# EAGLE design ARE_adaptadora_PIC_28pin (EAGLE 6.5.0)
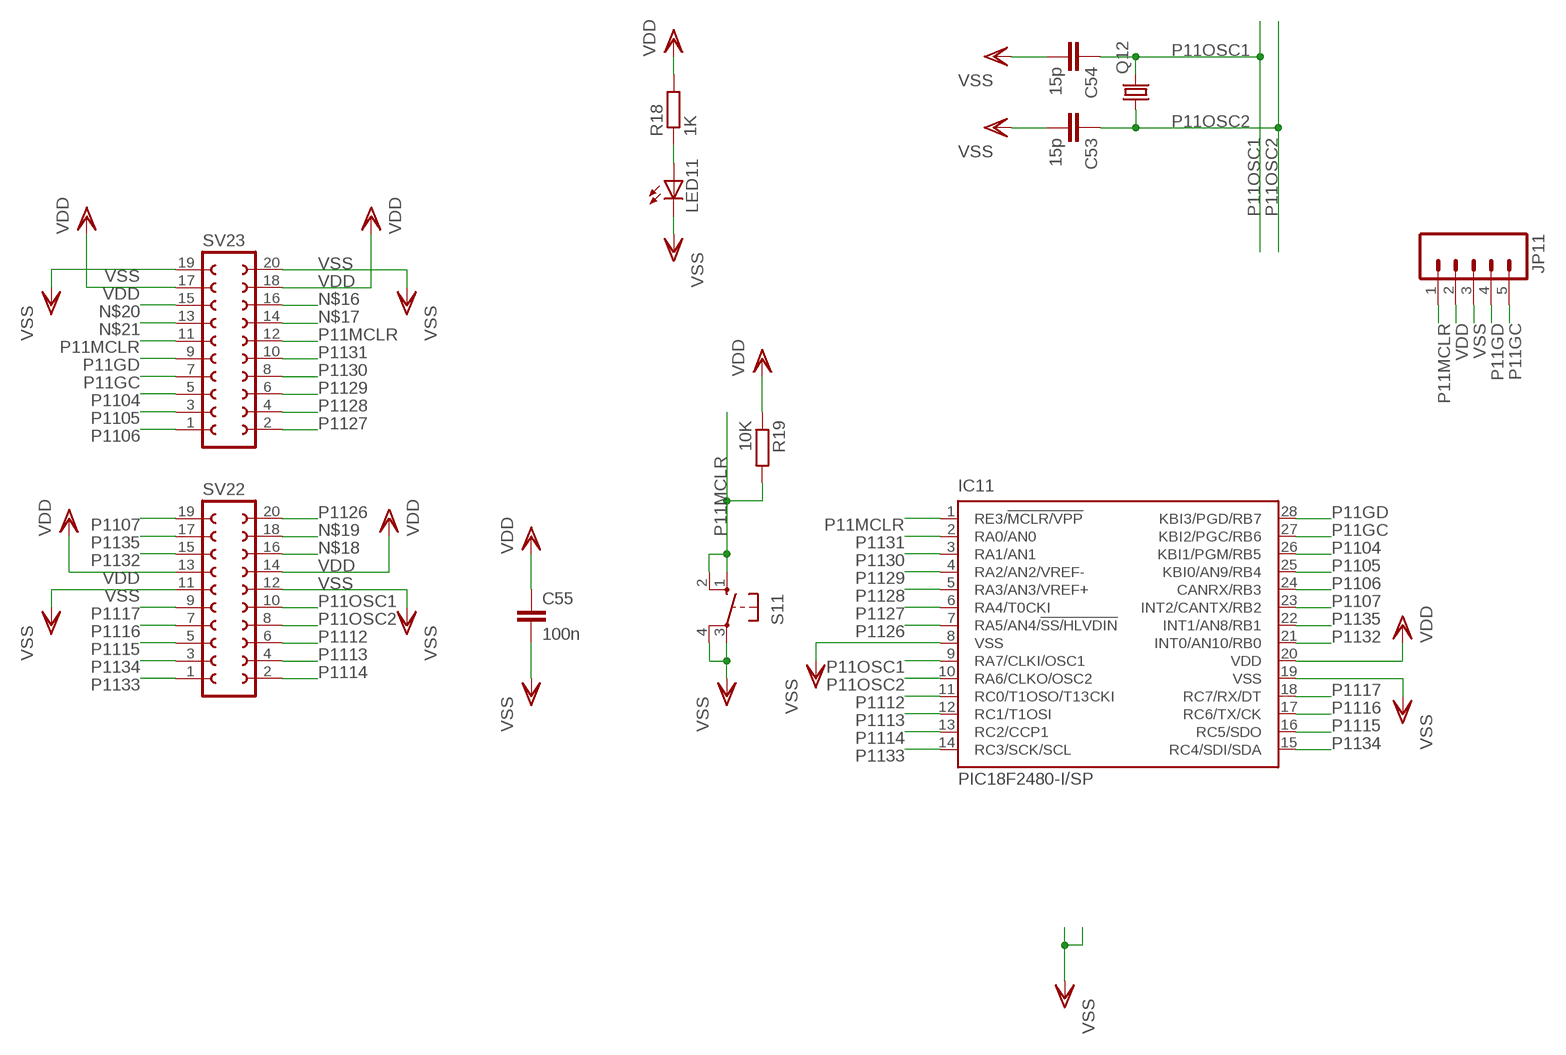
[diagram p0: schematic, sheet 1]

## Parts
C53  15p  C-EUC0805  [C0805]
C54  15p  C-EUC0805  [C0805]
C55  100n  C-EUC0805  [C0805]
IC11  PIC18F2480-I/SP  [DIL28-3]
JP11  M05PTH  [1X05]
LED11  LED3MM  [LED3MM]
Q12  CRYSTALHC18U-V  [HC18U-V]
R18  1K  R-EU_R0805  [R0805]
R19  10K  R-EU_R0805  [R0805]
S11  10-XX  [B3F-10XX]
SV22  FE10-2W  [FE10-2W]
SV23  FE10-2W  [FE10-2W]

## Nets
N$15: LED11.A R18.1
N$16: SV23.16
N$17: SV23.14
N$18: SV22.16
N$19: SV22.18
N$20: SV23.15
N$21: SV23.13
P11GC: IC11.27(KBI2/PGC/RB6) JP11.5 SV23.7
P11GD: IC11.28(KBI3/PGD/RB7) JP11.4 SV23.9
P11MCLR: IC11.1(RE3/!MCLR/VPP) JP11.1 R19.2 S11.1(S) S11.2(S1) SV23.11 SV23.12
P11OSC1: C54.1 IC11.9(RA7/CLKI/OSC1) Q12.2 SV22.10
P11OSC2: C53.1 IC11.10(RA6/CLKO/OSC2) Q12.1 SV22.8
P1104: IC11.26(KBI1/PGM/RB5) SV23.5
P1105: IC11.25(KBI0/AN9/RB4) SV23.3
P1106: IC11.24(CANRX/RB3) SV23.1
P1107: IC11.23(INT2/CANTX/RB2) SV22.19
P1112: IC11.11(RC0/T1OSO/T13CKI) SV22.6
P1113: IC11.12(RC1/T1OSI) SV22.4
P1114: IC11.13(RC2/CCP1) SV22.2
P1115: IC11.16(RC5/SDO) SV22.5
P1116: IC11.17(RC6/TX/CK) SV22.7
P1117: IC11.18(RC7/RX/DT) SV22.9
P1126: IC11.7(RA5/AN4/!SS/HLVDIN) SV22.20
P1127: IC11.6(RA4/T0CKI) SV23.2
P1128: IC11.5(RA3/AN3/VREF+) SV23.4
P1129: IC11.4(RA2/AN2/VREF-) SV23.6
P1130: IC11.3(RA1/AN1) SV23.8
P1131: IC11.2(RA0/AN0) SV23.10
P1132: IC11.21(INT0/AN10/RB0) SV22.15
P1133: IC11.14(RC3/SCK/SCL) SV22.1
P1134: IC11.15(RC4/SDI/SDA) SV22.3
P1135: IC11.22(INT1/AN8/RB1) SV22.17
VDD: C55.1 IC11.20(VDD) JP11.2 R18.2 R19.1 SV22.13 SV22.14 SV23.17 SV23.18
VSS: C53.2 C54.2 C55.2 IC11.8(VSS) IC11.19(VSS) JP11.3 LED11.K(C) S11.3(P) S11.4(P1) SV22.11 SV22.12 SV23.19 SV23.20

## Library data of the parts
C53-C55 = rcl:C-EU: CAPACITOR, European symbol
IC11 = microchip:PIC18F2*80: 28-Pin Enhanced Flash Microcontrollers with ECAN(TM) Technology 10-Bit A/D and nanoWatt Technology Source: http://www.microchip.com .. 39637a.pdf; MF: MICROCHIP; MPN: PIC18F2480-I/SP; OC_FARNELL: 9321217; OC_NEWARK: 71J7237
JP11 = SparkFun:M05: Header 5 Standard 5-pin 0.1" header. Use with straight break away headers (SKU : PRT-00116), right angle break away headers (PRT-00553), swiss pins (PRT-00743), machine pins (PRT-00117), and female headers (PRT-00115). Molex polarized connector foot print use with SKU : PRT-08230 with associated crimp pins and housings.
LED11 = SparkFun:LED: LEDs Standard schematic elements and footprints for 5mm, 3mm, 1206, and 0603 sized LEDs. 5mm - Spark Fun Electronics SKU : COM-00529 (and others)
Q12 = crystal:CRYSTAL: CRYSTAL; OC_FARNELL: unknown; OC_NEWARK: unknown
R18 R19 = rcl:R-EU_: RESISTOR, European symbol
S11 = switch-omron:10-XX: OMRON SWITCH; MPN: B3F-1000; OC_FARNELL: 176432; OC_NEWARK: 36M3542
SV22 SV23 = con-lsta:FE10-2W: FEMALE HEADER; OC_FARNELL: unknown; OC_NEWARK: unknown

## Board
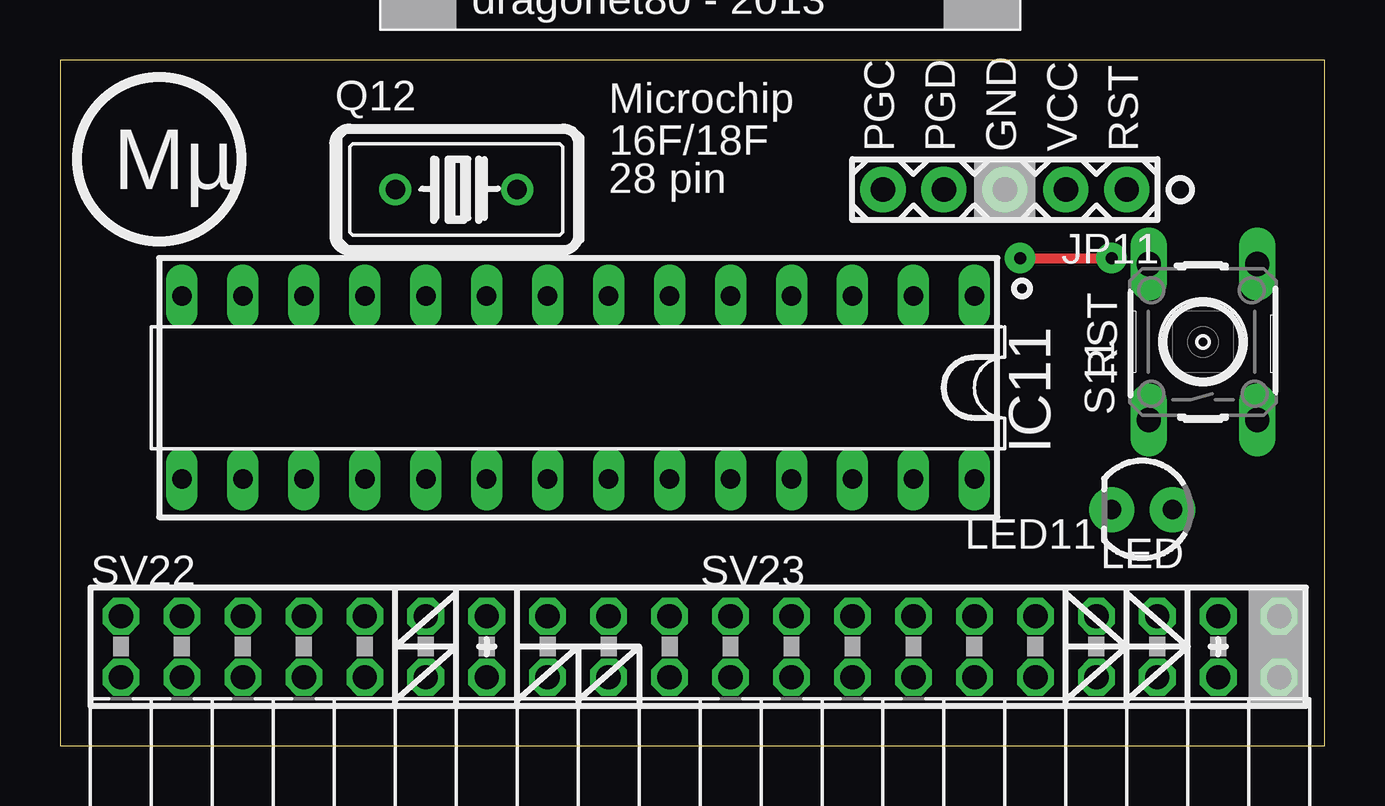
[diagram p1: board, top side]
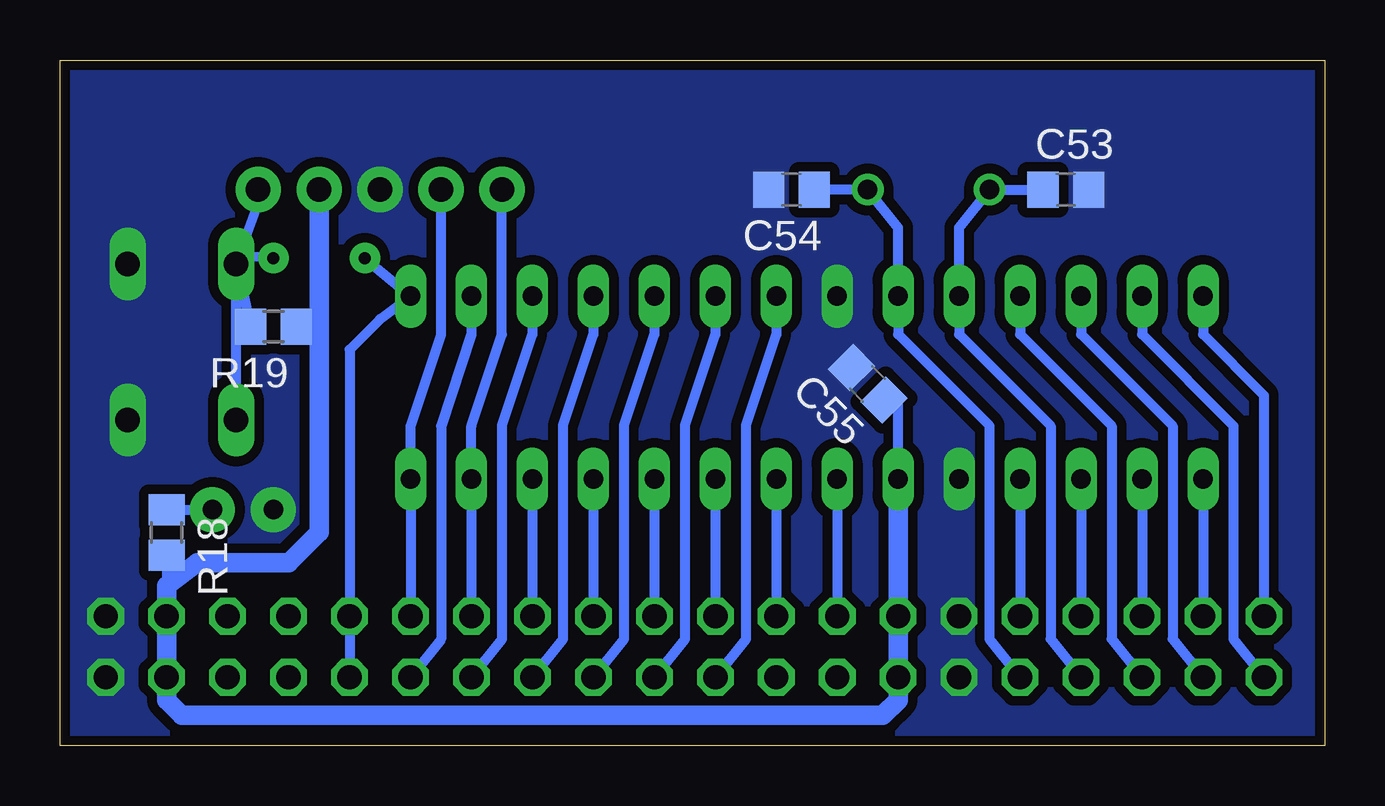
[diagram p2: board, bottom side, seen from below]

Size 52.7 x 28.57 mm. Coordinates in mm from the lower left corner, seen from the top.
Outline: 0,0 52.7,0 52.7,28.58 0,28.58 0,0
Copper layers (1*16): Top 0.035mm / dielectric 1.5mm / Bottom 0.035mm
Design rules "ITEADstudio_DRC": minimum track width 6mil, minimum drill 12mil, track to track 6mil, track to pad 6mil, pad to pad 6mil, via to via 6mil, smd to smd 0mil, copper to edge 10mil, drill to drill 10mil, minimum pad ring 10mil, minimum via ring 6mil, stop-mask expansion 2mil, vias tented up to drill 100mil, thermal gap 10mil

### Footprints (pad centres in the part's own frame; a part is rotated, then mirrored left to right if it is on the bottom)
C0805 = smd 1.3 x 1.5: 1 -0.95,0; 2 0.95,0
DIL28-3 = drill 0.813 long: 1 -16.51,-3.81; 2 -13.97,-3.81; 3 -11.43,-3.81; 4 -8.89,-3.81; 5 -6.35,-3.81; 6 -3.81,-3.81; 7 -1.27,-3.81; 8 1.27,-3.81; 9 3.81,-3.81; 10 6.35,-3.81; 11 8.89,-3.81; 12 11.43,-3.81; 13 13.97,-3.81; 14 16.51,-3.81; 15 16.51,3.81; 16 13.97,3.81; 17 11.43,3.81; 18 8.89,3.81; 19 6.35,3.81; 20 3.81,3.81; 21 1.27,3.81; 22 -1.27,3.81; 23 -3.81,3.81; 24 -6.35,3.81; 25 -8.89,3.81; 26 -11.43,3.81; 27 -13.97,3.81; 28 -16.51,3.81
1X05 = drill 1.016 pad 1.88: 1 0,0; 2 2.54,0; 3 5.08,0; 4 7.62,0; 5 10.16,0
LED3MM = drill 0.813 pad 1.88: A -1.27,0; K 1.27,0
HC18U-V = drill 0.813: 1 -2.54,0; 2 2.54,0
R0805 = smd 1.3 x 1.5: 1 -0.95,0; 2 0.95,0
B3F-10XX = drill 1.016 long: 1 -3.251,2.261; 2 3.251,2.261; 3 -3.251,-2.261; 4 3.251,-2.261
FE10-2W = drill 1.016 octagon: 1 -11.43,1.27; 2 -11.43,-1.27; 3 -8.89,1.27; 4 -8.89,-1.27; 5 -6.35,1.27; 6 -6.35,-1.27; 7 -3.81,1.27; 8 -3.81,-1.27; 9 -1.27,1.27; 10 -1.27,-1.27; 11 1.27,1.27; 12 1.27,-1.27; 13 3.81,1.27; 14 3.81,-1.27; 15 6.35,1.27; 16 6.35,-1.27; 17 8.89,1.27; 18 8.89,-1.27; 19 11.43,1.27; 20 11.43,-1.27

### Placement (x,y rotation side)
C53  10.8,23.18 0 bottom
C54  22.23,23.18 180 bottom
C55  19.05,15.08 135 bottom
IC11  21.59,14.92 180 top
JP11  44.45,23.18 180 top
LED11  45.08,9.84 180 top
Q12  16.51,23.18 0 top
R18  48.26,8.89 270 bottom
R19  43.81,17.46 180 bottom
S11  47.62,16.83 90 top
SV22  13.97,4.13 0 top
SV23  39.37,4.13 0 top

### Tracks (layer width: path | path; a pad name or v marks a point on that pad's centre or on a via)
N$15
  Bottom 0.406: R18.1 47.62,9.84 LED11.A
P11GC
  Bottom 0.406: JP11.5 34.29,17.15 35.56,13.34 IC11.27 SV23.7
P11GD
  Bottom 0.406: JP11.4 36.83,17.15 38.1,13.34 IC11.28 SV23.9
P11MCLR  (via drill 0.5 pad 1.27)
  Top 0.406: v40,20.32 v43.81,20.32
  Bottom 0.406: SV23.12 SV23.11 40.64,16.51 39.37,17.78 IC11.1 v40,20.32 | S11.1 45.36,18.69 45.08,19.05 | S11.2 45.36,19.41 45.08,19.05 | R19.2 45.08,19.05 | S11.2 44.45,22.58 JP11.1 | v43.81,20.32 45.01,20.4 S11.2
P11OSC1
  Bottom 0.406: SV22.10 13.97,4.44 13.97,13.34 17.78,17.15 IC11.9 17.78,21.59 Q12.2 C54.1
P11OSC2
  Bottom 0.406: SV22.8 11.43,4.44 11.43,13.34 15.24,17.15 IC11.10 15.24,21.59 Q12.1 C53.1
P1104
  Bottom 0.406: IC11.26 SV23.5
P1105
  Bottom 0.406: IC11.25 SV23.3
P1106
  Bottom 0.406: IC11.24 SV23.1
P1107
  Bottom 0.406: IC11.23 SV22.19
P1112
  Bottom 0.406: IC11.11 12.7,17.15 8.89,13.34 8.89,4.44 SV22.6
P1113
  Bottom 0.406: IC11.12 10.16,17.15 6.35,13.34 6.35,4.44 SV22.4
P1114
  Bottom 0.406: IC11.13 7.62,17.15 3.81,13.34 3.81,4.44 SV22.2
P1115
  Bottom 0.406: IC11.16 SV22.5
P1116
  Bottom 0.406: IC11.17 SV22.7
P1117
  Bottom 0.406: IC11.18 SV22.9
P1126
  Bottom 0.406: IC11.7 22.86,17.15 24.13,13.34 24.13,4.44 SV22.20
P1127
  Bottom 0.406: IC11.6 25.4,17.15 26.67,13.34 26.67,4.44 SV23.2
P1128
  Bottom 0.406: IC11.5 27.94,17.15 29.21,13.34 29.21,4.44 SV23.4
P1129
  Bottom 0.406: IC11.4 30.48,17.15 31.75,13.34 31.75,4.44 SV23.6
P1130
  Bottom 0.406: IC11.3 33.02,17.15 34.29,13.34 34.29,4.44 SV23.8
P1131
  Bottom 0.406: IC11.2 35.56,17.15 36.83,13.34 36.83,4.44 SV23.10
P1132
  Bottom 0.406: IC11.21 SV22.15
P1133
  Bottom 0.406: IC11.14 5.08,17.15 2.54,14.61 SV22.1
P1134
  Bottom 0.406: IC11.15 SV22.3
P1135
  Bottom 0.406: IC11.22 SV22.17
VDD
  Bottom 0.406: IC11.20 17.78,14.29 C55.1 | R18.2 48.26,6.67 | R19.1 41.91,17.78
  Bottom 0.813: JP11.2 41.91,17.78 41.91,8.89 43.18,7.62 46.99,7.62 48.26,6.67 SV23.17 SV23.18 48.26,1.91 47.62,1.27 18.41,1.27 17.78,1.91 SV22.14 SV22.13 IC11.20
VSS
  pour Bottom (isolate 0.406, no thermals): 0,0 52.7,0 52.7,28.57 0,28.57

### Text on the board
_tsilk: CC by nc sa | dragonet80 - 2013 | Microchip | PGC | PGD | GND | VCC | RST | 16F/18F | Mµ | 28 pin | RST | LED